# Altium project Hardware_Controller_2019-20.PrjPCB
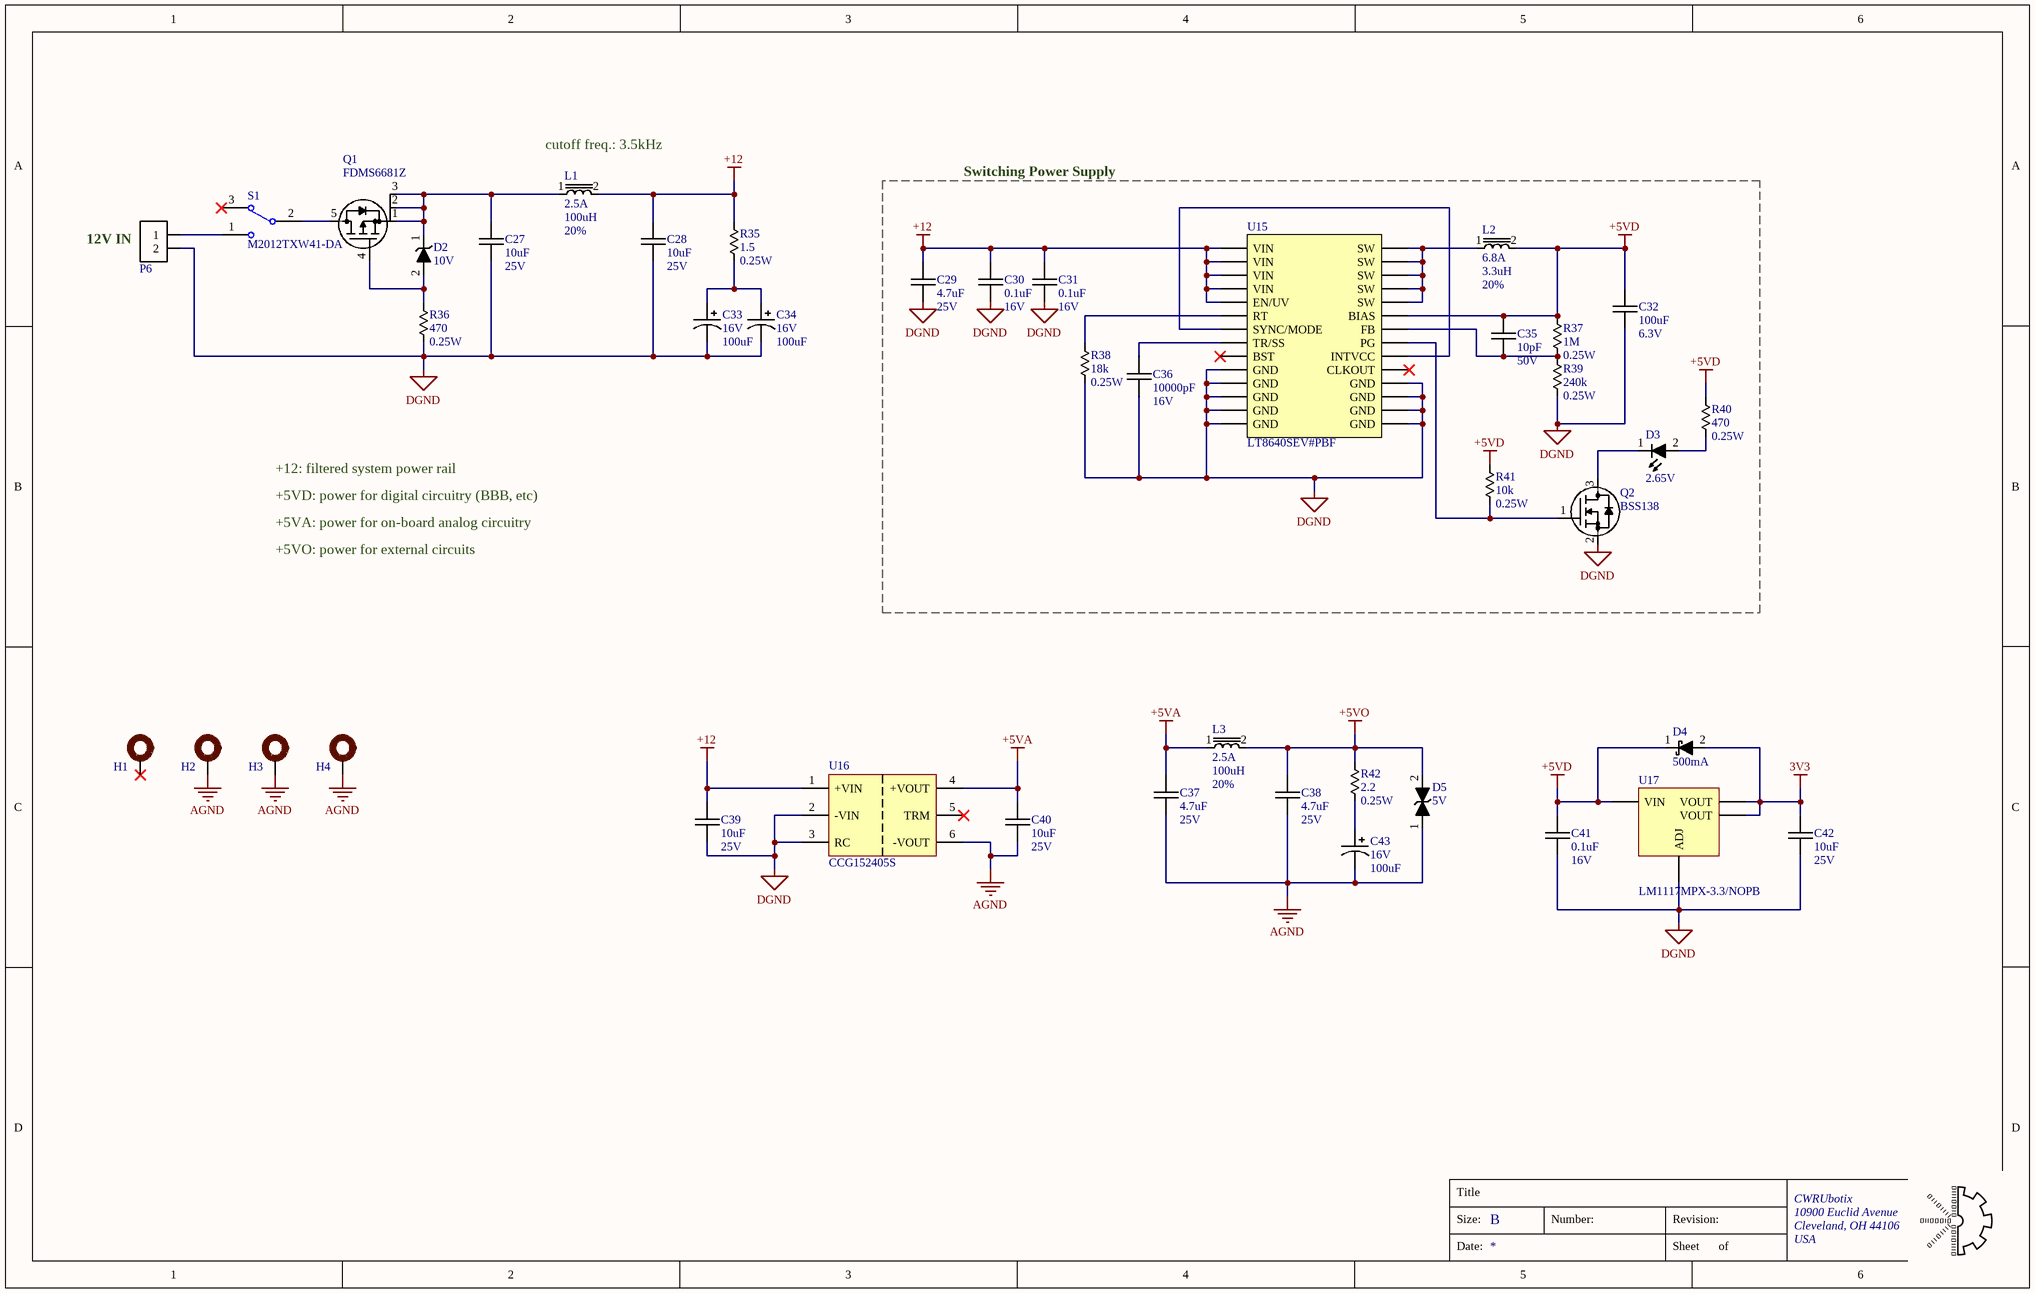
[diagram p0: power_SCH1.SchDoc]
4 sheets, 128 parts. Net scope: flat (ports and power ports of the same name join across sheets).
Board file: HardwareControllerPCB.PcbDoc
Sheets:
  power_SCH1.SchDoc
  BBB_SCH2.SchDoc
  IO_SCH3.SchDoc
  Analog_SCH4.SchDoc

## Sheet power_SCH1.SchDoc
size B; Organization: CWRUbotix; Address1: 10900 Euclid Avenue; Address2: Cleveland, OH 44106; Address3: USA

### Parts
C27  Capacitance: 10uF  Voltage Rating: 25V  [chip_1206]  (hidden comment: cap_single_np)
C28  Capacitance: 10uF  Voltage Rating: 25V  [chip_1206]  (hidden comment: cap_single_np)
C29  Capacitance: 4.7uF  Voltage Rating: 25V  [chip_0805]  (hidden comment: cap_single_np)
C30  Capacitance: 0.1uF  Voltage Rating: 16V  [chip_0603]  (hidden comment: cap_single_np)
C31  Capacitance: 0.1uF  Voltage Rating: 16V  [chip_0603]  (hidden comment: cap_single_np)
C32  Capacitance: 100uF  Voltage Rating: 6.3V  [chip_1206]  (hidden comment: cap_single_np)
C33  Voltage Rating: 16V  Capacitance: 100uF  [chip_2917_AVX_TAJD]  (hidden comment: cap_single_p)
C34  Voltage Rating: 16V  Capacitance: 100uF  [chip_2917_AVX_TAJD]  (hidden comment: cap_single_p)
C35  Capacitance: 10pF  Voltage Rating: 50V  [chip_0603]  (hidden comment: cap_single_np)
C36  Capacitance: 10000pF  Voltage Rating: 16V  [chip_0603]  (hidden comment: cap_single_np)
C37  Capacitance: 4.7uF  Voltage Rating: 25V  [chip_0805]  (hidden comment: cap_single_np)
C38  Capacitance: 4.7uF  Voltage Rating: 25V  [chip_0805]  (hidden comment: cap_single_np)
C39  Capacitance: 10uF  Voltage Rating: 25V  [chip_1206]  (hidden comment: cap_single_np)
C40  Capacitance: 10uF  Voltage Rating: 25V  [chip_1206]  (hidden comment: cap_single_np)
C41  Capacitance: 0.1uF  Voltage Rating: 16V  [chip_0603]  (hidden comment: cap_single_np)
C42  Capacitance: 10uF  Voltage Rating: 25V  [chip_1206]  (hidden comment: cap_single_np)
C43  Voltage Rating: 16V  Capacitance: 100uF  [chip_2917_AVX_TAJD]  (hidden comment: cap_single_p)
D2  Reverse Breakdown Voltage: 10V  [sod323_0]  (hidden comment: diode_1)
D3  Forward Voltage: 2.65V  [chip_0603]  (hidden comment: diode_4)
D4  Current Rating: 500mA  [sod323_0]  (hidden comment: diode_2)
D5  Reverse Breakdown Voltage: 5V  [do-214ac]  (hidden comment: diode_5)
H1  mounting_hole_0  [#8-32_SOCKET_HEAD]  (value not drawn)
H2  mounting_hole_0  [#8-32_SOCKET_HEAD]  (value not drawn)
H3  mounting_hole_0  [#8-32_SOCKET_HEAD]  (value not drawn)
H4  mounting_hole_0  [#8-32_SOCKET_HEAD]  (value not drawn)
L1  Current Rating: 2.5A  Inductance: 100uH  Tolerance: 20%  [WURTH_7447709101]  (hidden comment: ind_1)
L2  Current Rating: 6.8A  Inductance: 3.3uH  Tolerance: 20%  [TDK_SPM6530]  (hidden comment: ind_1)
L3  Current Rating: 2.5A  Inductance: 100uH  Tolerance: 20%  [WURTH_7447709101]  (hidden comment: ind_1)
P6  conn-2x1_0  [TERM_3.50MM_2x1_0]  (value not drawn)
Q1  Manufacturer PN: FDMS6681Z  [PQFN-8-5x6]  (hidden comment: p-mosfet_3)
Q2  Manufacturer PN: BSS138  [sot-23-3]  (hidden comment: n-mosfet_1)
R35  Resistance: 1.5  Power Rating: 0.25W  [chip_0805]  (hidden comment: res_single)
R36  Resistance: 470  Power Rating: 0.25W  [chip_0603]  (hidden comment: res_single)
R37  Resistance: 1M  Power Rating: 0.25W  [chip_0603]  (hidden comment: res_single)
R38  Resistance: 18k  Power Rating: 0.25W  [chip_0603]  (hidden comment: res_single)
R39  Resistance: 240k  Power Rating: 0.25W  [chip_0603]  (hidden comment: res_single)
R40  Resistance: 470  Power Rating: 0.25W  [chip_0603]  (hidden comment: res_single)
R41  Resistance: 10k  Power Rating: 0.25W  [chip_0603]  (hidden comment: res_single)
R42  Resistance: 2.2  Power Rating: 0.25W  [chip_0805]  (hidden comment: res_single)
S1  Manufacturer PN: M2012TXW41-DA  [M2012TXG41-DC]  (hidden comment: SW-SPDT)
U15  Manufacturer PN: LT8640SEV#PBF  [LQFN-24_0]  (hidden comment: LT8640S)
U16  Manufacturer PN: CCG152405S  [CCG15]  (hidden comment: CCG15)
U17  Manufacturer PN: LM1117MPX-3.3/NOPB  [sot-223-4]  (hidden comment: LM1117)

### Blocks framed on the sheet
Switching Power Supply: C29-C32 C35 C36 D3 L2 Q2 R37-R41 U15

### Nets
3V3: C42.1 D4.2 U17.2(VOUT) U17.4(VOUT)
+5VA: C37.1 C40.1 L3.1 U16.4(+VOUT)
+5VD: C32.1 C35.1 C41.1 D4.1 L2.2 R37.1 R40.2 R41.1 U15.1(BIAS) U17.3(VIN)
+5VO: C38.1 D5.2 L3.2 R42.1
+12: C28.1 C29.1 C30.1 C31.1 C39.1 L1.2 R35.1 U15.5(VIN) U15.6(VIN) U15.13(VIN) U15.14(VIN) U15.17(EN/UV) U16.1(+VIN)
AGND: C37.2 C38.2 C40.2 C43.2 D5.1 H2.0(A) H3.0(A) H4.0(A) U16.6(-VOUT)
DGND: C27.2 C28.2 C29.2 C30.2 C31.2 C32.2 C33.2 C34.2 C36.2 C39.2 C41.2 C42.2 P6.2 Q2.2(S) R36.2 R38.2 R39.2 U15.3(GND) U15.4(GND) U15.15(GND) U15.16(GND) U15.25(GND) U15.26(GND) U15.27(GND) U15.28(GND) U16.2(-VIN) U16.3(RC) U17.1(ADJ)
NetC27_1: C27.1 D2.1 L1.1 Q1.1(S) Q1.2(S) Q1.3(S)
NetC33_1: C33.1 C34.1 R35.2
NetC35_2: C35.2 R37.2 R39.1 U15.24(FB)
NetC36_1: C36.1 U15.21(TR/SS)
NetC43_1: C43.1 R42.2
NetD2_2: D2.2 Q1.4(G) R36.1
NetD3_1: D3.1 Q2.3(D)
NetD3_2: D3.2 R40.1
NetL2_1: L2.1 U15.8(SW) U15.9(SW) U15.10(SW) U15.11(SW) U15.12(SW)
NetP6_1: P6.1 S1.1
NetQ1_5: Q1.5(D) S1.2
NetQ2_1: Q2.1(G) R41.2 U15.23(PG)
NetR38_1: R38.1 U15.18(RT)
NetU15_2: U15.2(INTVCC) U15.20(SYNC/MODE)

Not connected (* = marked no-connect by the designer): H1 0(A)*; S1 3*; U15 7(BST)* 19(CLKOUT)*; U16 5(TRM)*

### Notes on the sheet
- (near L1) cutoff freq.: 3.5kHz
- (near P6) 12V IN
- +12: filtered system power rail
- +5VD: power for digital circuitry (BBB, etc)
- +5VO: power for external circuits
- +5VA: power for on-board analog circuitry
- Title
- Size:
- B
- Number:
- Revision:
- Date:
- Sheet
- of

### Library data of the parts
C27 C28 C39 C40 C42 = CAP-00539: CAP, 10uF, ±10%, 25V, X7R, 1206; Manufacturer: Samsung; Manufacturer PN: CL31B106KAHNNNE; Tolerance: ±10%; Part Number: CAP-00539; Type: X7R
C29 C37 C38 = CAP-00128: CAP, 4.7uF, 10%, 25V, X7R, 0805; Manufacturer: Murata; Manufacturer PN: GRM21BR71E475KA73L; Tolerance: 10%; Part Number: CAP-00128; Type: X7R
C30 C31 C41 = CAP-00542: CAP, 0.1uF, ±10%, 16V, X7R, 0603; Manufacturer: Murata; Tolerance: ±10%; Part Number: CAP-00542; Type: X7R
C32 = CAP-00551: CAP, 100uF, ±20%, 6.3V, X5R, 1206; Manufacturer: Samsung Electro-Mechanics; Manufacturer PN: CL31A107MQHNNNE; Tolerance: ±20%; Part Number: CAP-00551; Type: X5R; Cost: $0.64
C33 C34 C43 = CAP-00550: CAP, 100uF, ±10%, 16V, Tantalum, 2917; Manufacturer: AVX; Manufacturer PN: TAJD107K016RNJ; Tolerance: ±10%; Part Number: CAP-00550; Type: Tantalum; Cost: $0.94
C35 = CAP-00471: CAP, 10pF, ±2%, 50V, C0G, 0603; Manufacturer: Murata; Manufacturer PN: GRM1885C1H100GA01D; Tolerance: ±2%; Part Number: CAP-00471; Type: C0G
C36 = CAP-00543: CAP, 10000pF, ±10%, 16V, X7R, 0603; Tolerance: ±10%; Part Number: CAP-00543; Type: X7R
D2 = DIO-00019: Dio Zen, 10V, 2%, 200mW, SOD-323; Manufacturer: ON Semi; Manufacturer PN: MM3Z10VST1G; Forward Voltage: 900mV; Type: Zener; Part Number: DIO-00019; Tolerance: 2%; Power Rating: 200mW
D3 = DIO-00049: LED, Blue, 0603, Low current, HELI2 Series; Manufacturer: Kingbright; Manufacturer PN: APT1608LVBC/D; Reverse Breakdown Voltage: 5V; Current Rating: 30mA; Power Rating: 120mW; Type: LED; Part Number: DIO-00049; Cost: 0.58
D4 = DIO-00000: Dio Shtky, 500mA, 0.62V, 30V, SOD-323; Manufacturer: ON Semi; Manufacturer PN: NSR0530HT1G; Forward Voltage: 620mV; Type: Schottky; Reverse Breakdown Voltage: 30V; Part Number: DIO-00000
D5 = DIO-00036: TVS, 5V, 400W; Manufacturer: ST; Manufacturer PN: SMAJ5.0A-TR; Type: TVS; Part Number: DIO-00036; Power Rating: 400W
H1-H4 = MISC-00027: #8-32 Mounting Hole for Socket Head Cap Screw; Part Number: MISC-00027
L1 L3 = MAG-00102: Ind, 100uH, 20%, 2.5A, 0.11 Ohm; Manufacturer: Wurth; Manufacturer PN: 7447709101; DCR: 110mOhm; Part Number: MAG-00102; Cost: 2.41; Weight: 7
L2 = MAG-00093: Ind, 3.3uH, 20%, 6.8A, EP5; Manufacturer: TDK; Manufacturer PN: SPM6530T-3R3M; DCR: 29.7 mOhm; Part Number: MAG-00093; Cost: 1.41; Weight: 0.7
P6 = CONN-00023: Term Blk, 2 Pos, 16A, 3.5mm Pitch; Manufacturer: Phoenix Contact; Manufacturer PN: 1861933; Positions per level: 2; Levels: 1; Current: 16; Part Number: CONN-00023; Type: Terminal Block; Cost: 0.79
Q1 = XSTR-00026: XSTR PMOS, 21.1A, 30V, Vgs 3V, PQFN8 5X6; Manufacturer: ON Semi; Max Power: 73W; Type: PFET; Max Current: 21.1A; Max Voltage: 30V; Part Number: XSTR-00026; Vgs/Vce: 3V; Cost: 1.82
Q2 = XSTR-00017: XSTR NMOS, 220mA, 50V, Vgs 1.3V, SOT-23-3; Manufacturer: ON Semi; Max Power: 360mW; Type: NFET; Max Current: 220mA; Max Voltage: 50V; Part Number: XSTR-00017; Vgs/Vce: 1.3V; Cost: 0.31
R35 = RES-00600: RES SMD 1.5 OHM 1% 1/4W 0805; Tolerance: 1%; Part Number: RES-00600
R36 R40 = RES-00236: RES SMD 470 OHM 1% 1/4W 0603; Manufacturer: Panasonic; Manufacturer PN: ERJ-PA3F4700V; Tolerance: 1%; Part Number: RES-00236
R37 = RES-00362: RES SMD 1M OHM 1% 1/4W 0603; Manufacturer: Panasonic; Manufacturer PN: ERJ-PA3F1004V; Tolerance: 1%; Part Number: RES-00362
R38 = RES-00356: RES SMD 18K OHM 1% 1/4W 0603; Manufacturer: Panasonic; Manufacturer PN: ERJ-PA3F1802V; Tolerance: 1%; Part Number: RES-00356
R39 = RES-00397: RES SMD 240K OHM 1% 1/4W 0603; Manufacturer: Panasonic; Manufacturer PN: ERJ-PA3F2403V; Tolerance: 1%; Part Number: RES-00397
R41 = RES-00306: RES SMD 10K OHM 1% 1/4W 0603; Manufacturer: Panasonic; Manufacturer PN: ERJ-PA3F1002V; Tolerance: 1%; Part Number: RES-00306; Cost: 0.144
R42 = RES-00601: RES SMD 2.2 OHM 1% 1/4W 0805; Tolerance: 1%; Part Number: RES-00601
S1 = MISC-00009: Switch, SPDT, Rocker, Thru-hole, Right-angle; Manufacturer: NKK Switches; Current Rating: *A; ComponentLink1Description: Manufacturer Link; ComponentLink1URL: http://www.apem.com; Part Number: MISC-00009; Cost: 5.1
U15 = PWREG-00013: SW Reg, Silent Switcher 2, Low EMI; Manufacturer: Analog Devices; Voltage Range In: 3 - 42V; Voltage Range Out: 0.97 - 42V; Max Current: 6A; Frequency: 200kHz-3MHz; Reg Type: SW Buck; Fixed/Adj: Adj; Part Number: PWREG-00013; Cost: 11.15
U16 = PWREG-00021: Module, Isolated, 5V, 3A; Manufacturer: TDK-Lambda; Voltage Range In: 9 - 36V; Fixed/Adj: Fixed; Part Number: PWREG-00021; Voltage Range Out: 5V; Max Current: 3A; Weight: 20
U17 = PWREG-00018: REG, Linear, Fixed 3V3, 800mA, SOT-223; Manufacturer: TI; Voltage Range In: 4.5 - 15V; Voltage Range Out: 3.3V; Part Number: PWREG-00018; Max Current: 800mA; Reg Type: Linear; Fixed/Adj: Fixed; Cost: 1.14

## Sheet BBB_SCH2.SchDoc
size B; Organization: CWRUbotix; Address1: 10900 Euclid Avenue; Address2: Cleveland, OH 44106; Address3: USA
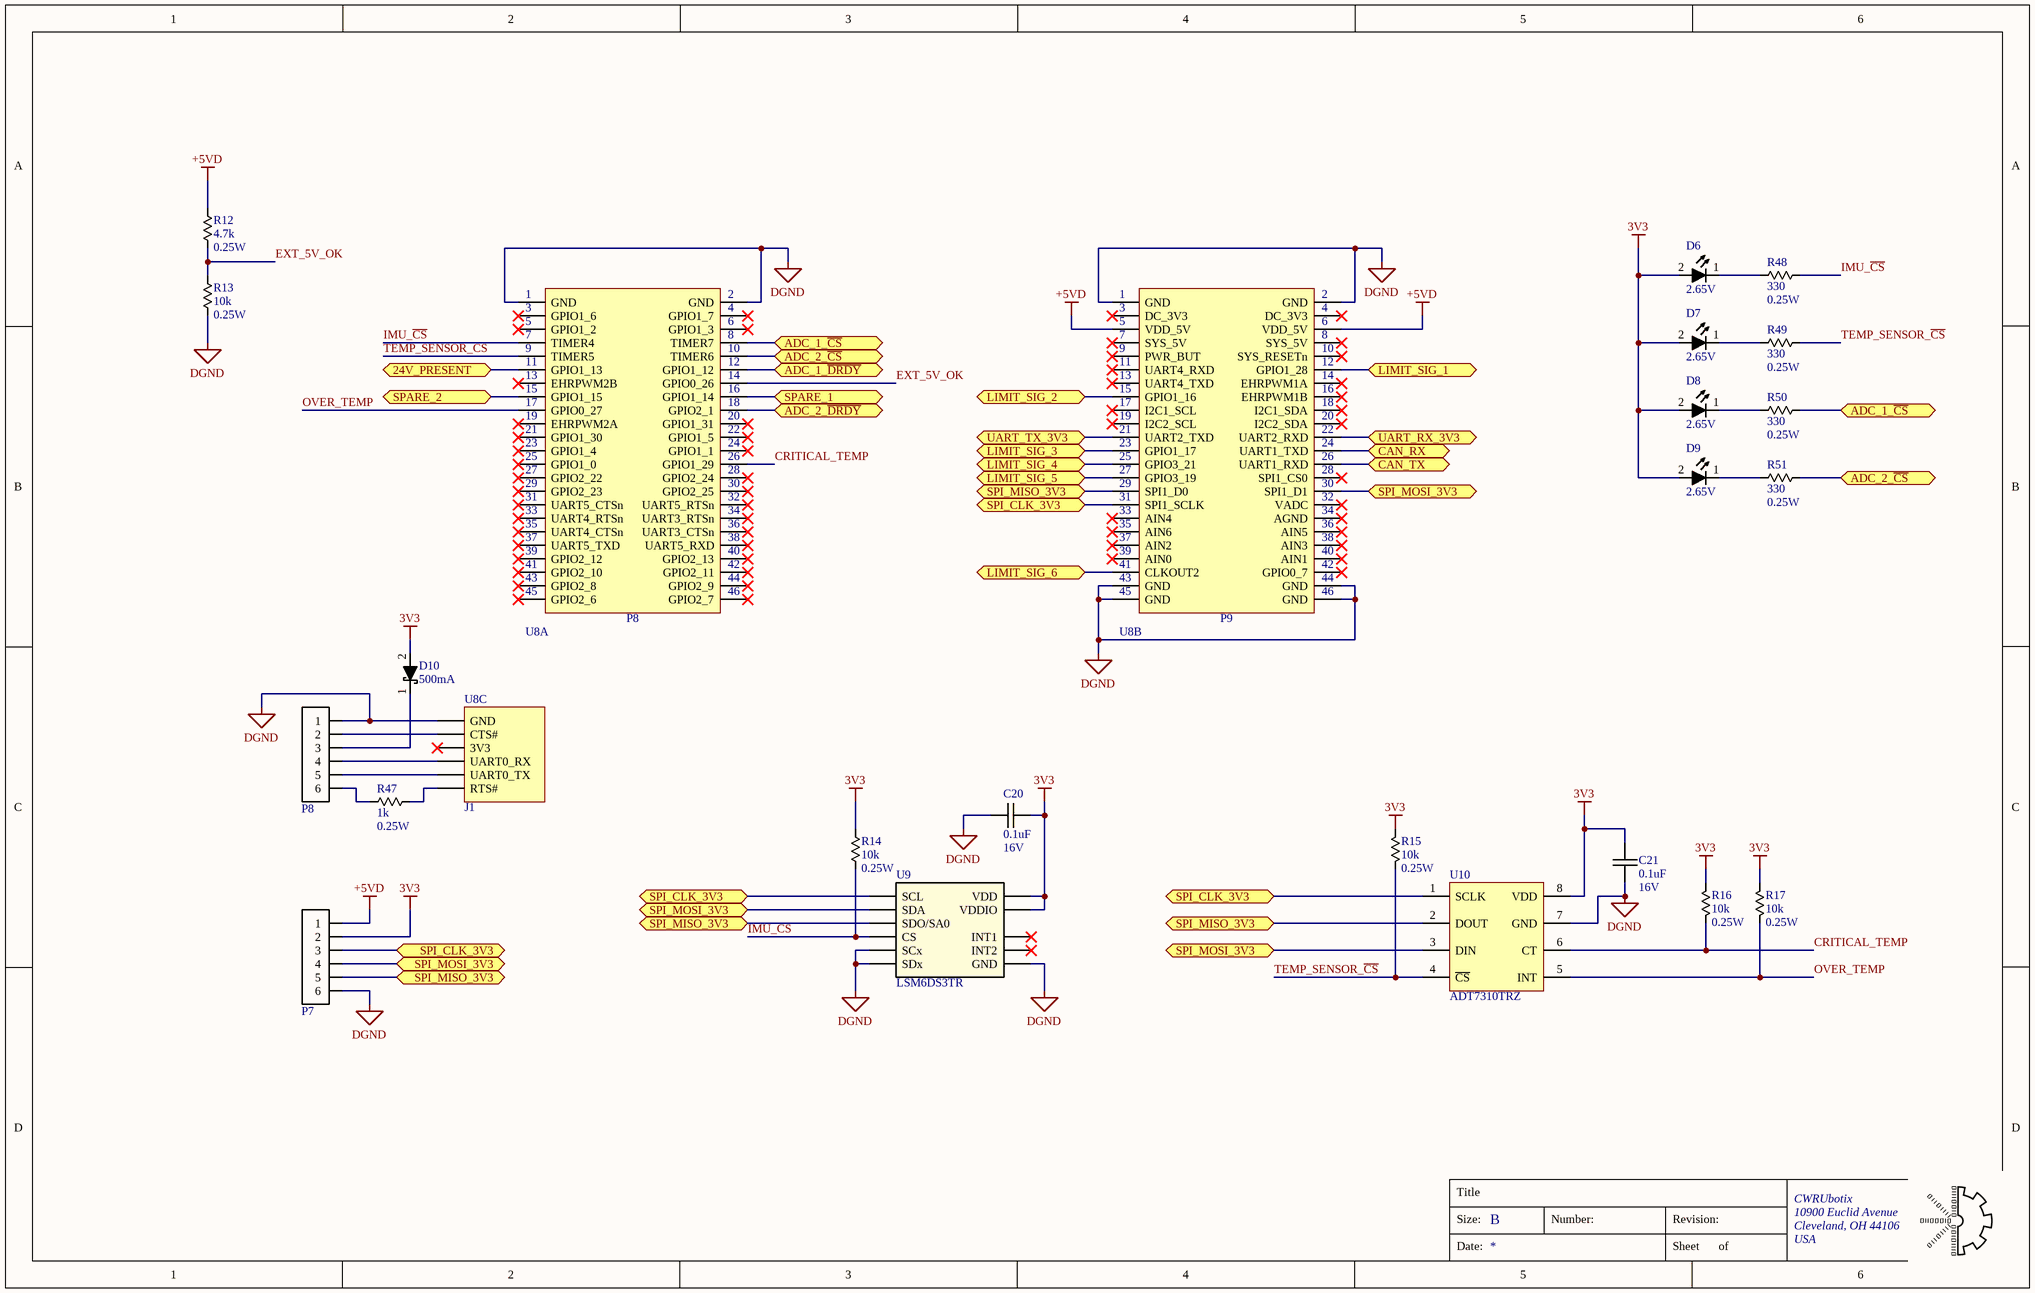
[diagram p1: BBB_SCH2.SchDoc]

### Parts
C20  Capacitance: 0.1uF  Voltage Rating: 16V  [chip_0603]  (hidden comment: cap_single_np)
C21  Capacitance: 0.1uF  Voltage Rating: 16V  [chip_0603]  (hidden comment: cap_single_np)
D6  Forward Voltage: 2.65V  [chip_0603]  (hidden comment: diode_4)
D7  Forward Voltage: 2.65V  [chip_0603]  (hidden comment: diode_4)
D8  Forward Voltage: 2.65V  [chip_0603]  (hidden comment: diode_4)
D9  Forward Voltage: 2.65V  [chip_0603]  (hidden comment: diode_4)
D10  Current Rating: 500mA  [sod323_0]  (hidden comment: diode_2)
P7  conn-6x1_0  [HDDR_6X1_0]  (value not drawn)
P8  conn-6x1_0  [SOCK_6x1_0]  (value not drawn)
R12  Resistance: 4.7k  Power Rating: 0.25W  [chip_0603]  (hidden comment: res_single)
R13  Resistance: 10k  Power Rating: 0.25W  [chip_0603]  (hidden comment: res_single)
R14  Resistance: 10k  Power Rating: 0.25W  [chip_0603]  (hidden comment: res_single)
R15  Resistance: 10k  Power Rating: 0.25W  [chip_0603]  (hidden comment: res_single)
R16  Resistance: 10k  Power Rating: 0.25W  [chip_0603]  (hidden comment: res_single)
R17  Resistance: 10k  Power Rating: 0.25W  [chip_0603]  (hidden comment: res_single)
R47  Resistance: 1k  Power Rating: 0.25W  [chip_0603]  (hidden comment: res_single)
R48  Resistance: 330  Power Rating: 0.25W  [chip_0603]  (hidden comment: res_single)
R49  Resistance: 330  Power Rating: 0.25W  [chip_0603]  (hidden comment: res_single)
R50  Resistance: 330  Power Rating: 0.25W  [chip_0603]  (hidden comment: res_single)
R51  Resistance: 330  Power Rating: 0.25W  [chip_0603]  (hidden comment: res_single)
U8  BBB  [BEAGLEBONE]  (value not drawn)  (parts A,B,C of 3)
U9  Manufacturer PN: LSM6DS3TR  [LGA14]  (hidden comment: LSM6DS3)
U10  Manufacturer PN: ADT7310TRZ  [SO-8]  (hidden comment: ADT7310)

### Ports
24V_PRESENT (bidir), ADC_1_~{CS} (bidir), ADC_1_~{DRDY} (bidir), ADC_2_~{CS} (bidir), ADC_2_~{DRDY} (bidir), CAN_RX (bidir), CAN_TX (bidir), LIMIT_SIG_1 (bidir), LIMIT_SIG_2 (bidir), LIMIT_SIG_3 (bidir), LIMIT_SIG_4 (bidir), LIMIT_SIG_5 (bidir), LIMIT_SIG_6 (bidir), SPARE_1 (bidir), SPARE_2 (bidir), SPI_CLK_3V3 (bidir), SPI_MISO_3V3 (bidir), SPI_MOSI_3V3 (bidir), UART_RX_3V3 (bidir), UART_TX_3V3 (bidir)

### Nets
3V3: C20.2 C21.2 D6.2 D7.2 D8.2 D9.2 D10.2 P7.2 R14.1 R15.1 R16.1 R17.1 U9.5(VDDIO) U9.8(VDD) U10.8(VDD)
+5VD: P7.1 R12.2 U8.51(VDD_5V) U8.52(VDD_5V)
DGND: C20.1 C21.1 P7.6 P8.1 R13.2 U8.1(GND) U8.2(GND) U8.47(GND) U8.48(GND) U8.89(GND) U8.90(GND) U8.91(GND) U8.92(GND) U8.J1_1(GND) U9.2(SDx) U9.3(SCx) U9.6(GND) U10.7(GND)
24V_PRESENT: U8.11(GPIO1_13) ; port 24V_PRESENT
ADC_1_~{CS}: R50.2 U8.8(TIMER7) ; port ADC_1_~{CS}
ADC_1_~{DRDY}: U8.12(GPIO1_12) ; port ADC_1_~{DRDY}
ADC_2_~{CS}: R51.2 U8.10(TIMER6) ; port ADC_2_~{CS}
ADC_2_~{DRDY}: U8.18(GPIO2_1) ; port ADC_2_~{DRDY}
CAN_RX: U8.70(UART1_TXD) ; port CAN_RX
CAN_TX: U8.72(UART1_RXD) ; port CAN_TX
CRITICAL_TEMP: R16.2 U8.26(GPIO1_29) U10.6(CT)
EXT_5V_OK: R12.1 R13.1 U8.14(GPIO0_26)
IMU_~{CS}: R14.2 R48.2 U8.7(TIMER4) U9.12(CS)
LIMIT_SIG_1: U8.58(GPIO1_28) ; port LIMIT_SIG_1
LIMIT_SIG_2: U8.61(GPIO1_16) ; port LIMIT_SIG_2
LIMIT_SIG_3: U8.69(GPIO1_17) ; port LIMIT_SIG_3
LIMIT_SIG_4: U8.71(GPIO3_21) ; port LIMIT_SIG_4
LIMIT_SIG_5: U8.73(GPIO3_19) ; port LIMIT_SIG_5
LIMIT_SIG_6: U8.87(CLKOUT2) ; port LIMIT_SIG_6
OVER_TEMP: R17.2 U8.17(GPIO0_27) U10.5(INT)
SPARE_1: U8.16(GPIO1_14) ; port SPARE_1
SPARE_2: U8.15(GPIO1_15) ; port SPARE_2
SPI_CLK_3V3: P7.3 U8.77(SPI1_SCLK) U9.13(SCL) U10.1(SCLK) ; port SPI_CLK_3V3
SPI_MISO_3V3: P7.5 U8.75(SPI1_D0) U9.1(SDO/SA0) U10.2(DOUT) ; port SPI_MISO_3V3
SPI_MOSI_3V3: P7.4 U8.76(SPI1_D1) U9.14(SDA) U10.3(DIN) ; port SPI_MOSI_3V3
TEMP_SENSOR_~{CS}: R15.2 R49.2 U8.9(TIMER5) U10.4(~{CS})
UART_RX_3V3: U8.68(UART2_RXD) ; port UART_RX_3V3
UART_TX_3V3: U8.67(UART2_TXD) ; port UART_TX_3V3
NetD6_1: D6.1 R48.1
NetD7_1: D7.1 R49.1
NetD8_1: D8.1 R50.1
NetD9_1: D9.1 R51.1
NetD10_1: D10.1 P8.3
NetP8_2: P8.2 U8.J1_2(CTS#)
NetP8_4: P8.4 U8.J1_4(UART0_RX)
NetP8_5: P8.5 U8.J1_5(UART0_TX)
NetP8_6: P8.6 R47.1
NetR47_2: R47.2 U8.J1_6(RTS#)

Not connected (* = marked no-connect by the designer): U8 3(GPIO1_6)* 4(GPIO1_7)* 5(GPIO1_2)* 6(GPIO1_3)* 13(EHRPWM2B)* 19(EHRPWM2A)* 20(GPIO1_31)* 21(GPIO1_30)* 22(GPIO1_5)* 23(GPIO1_4)* 24(GPIO1_1)* 25(GPIO1_0)* 27(GPIO2_22)* 28(GPIO2_24)* 29(GPIO2_23)* 30(GPIO2_25)* 31(UART5_CTSn)* 32(UART5_RTSn)* 33(UART4_RTSn)* 34(UART3_RTSn)* 35(UART4_CTSn)* 36(UART3_CTSn)* 37(UART5_TXD)* 38(UART5_RXD)* 39(GPIO2_12)* 40(GPIO2_13)* 41(GPIO2_10)* 42(GPIO2_11)* 43(GPIO2_8)* 44(GPIO2_9)* 45(GPIO2_6)* 46(GPIO2_7)* 49(DC_3V3)* 50(DC_3V3)* 53(SYS_5V)* 54(SYS_5V)* 55(PWR_BUT)* 56(SYS_RESETn)* 57(UART4_RXD)* 59(UART4_TXD)* 60(EHRPWM1A)* 62(EHRPWM1B)* 63(I2C1_SCL)* 64(I2C1_SDA)* 65(I2C2_SCL)* 66(I2C2_SDA)* 74(SPI1_CS0)* 78(VADC)* 79(AIN4)* 80(AGND)* 81(AIN6)* 82(AIN5)* 83(AIN2)* 84(AIN3)* 85(AIN0)* 86(AIN1)* 88(GPIO0_7)* J1_3(3V3)*; U9 4(INT1)* 7(GND) 9(INT2)* 10(NC) 11(NC)

### Notes on the sheet
- Title
- Size:
- B
- Number:
- Revision:
- Date:
- Sheet
- of
- (in symbol MISC-00020, part A) P8
- (in symbol MISC-00020, part B) P9
- (in symbol MISC-00020, part C) J1

### Library data of the parts
C20 C21 = CAP-00542: as C30 on sheet power_SCH1; Tolerance: ±10%; Part Number: CAP-00542; Type: X7R
D6-D9 = DIO-00049: as D3 on sheet power_SCH1; Type: LED; Part Number: DIO-00049; Cost: 0.58
D10 = DIO-00000: as D4 on sheet power_SCH1; Reverse Breakdown Voltage: 30V; Part Number: DIO-00000
P7 = CONN-00008: Header 6x1, 0.1"; Positions per level: 6; Levels: 1; Part Number: CONN-00008
P8 = CONN-00046: Female Socket, 6x1, 0.1"; Manufacturer: Samtec; Manufacturer PN: SSW-106-01-F-S; Positions per level: 6; Levels: 1; Part Number: CONN-00046; Type: Socket; Cost: 0.8
R12 = RES-00470: RES SMD 4.7K OHM 1% 1/4W 0603; Manufacturer: Panasonic; Manufacturer PN: ERJ-PA3F4701V; Tolerance: 1%; Part Number: RES-00470
R13-R17 = RES-00306: as R41 on sheet power_SCH1; Tolerance: 1%; Part Number: RES-00306; Cost: 0.144
R47 = RES-00360: RES SMD 1K OHM 1% 1/4W 0603; Manufacturer: Panasonic; Manufacturer PN: ERJ-PA3F1001V; Tolerance: 1%; Part Number: RES-00360
R48-R51 = RES-00221: RES SMD 330 OHM 1% 1/4W 0603; Manufacturer: Panasonic; Manufacturer PN: ERJ-PA3F3300V; Tolerance: 1%; Part Number: RES-00221
U8 = MISC-00020: Beaglebone Black; Manufacturer PN: BEAGLEBONE; Part Number: MISC-00020
U9 = MISC-00012: Accel & Gyro, 3-Axis, SPI/I2C; Manufacturer: STM; Part Number: MISC-00012; Cost: 3
U10 = ANLG-00048: IC, 0.5°C Accurate 16-bit Digital SPI Temperature Sensor, SOIC-8, ADT7310; Manufacturer: Analog Devices; Part Number: ANLG-00048; Cost: 3.93

## Sheet IO_SCH3.SchDoc
size B; Organization: CWRUbotix; Address1: 10900 Euclid Avenue; Address2: Cleveland, OH 44106; Address3: USA
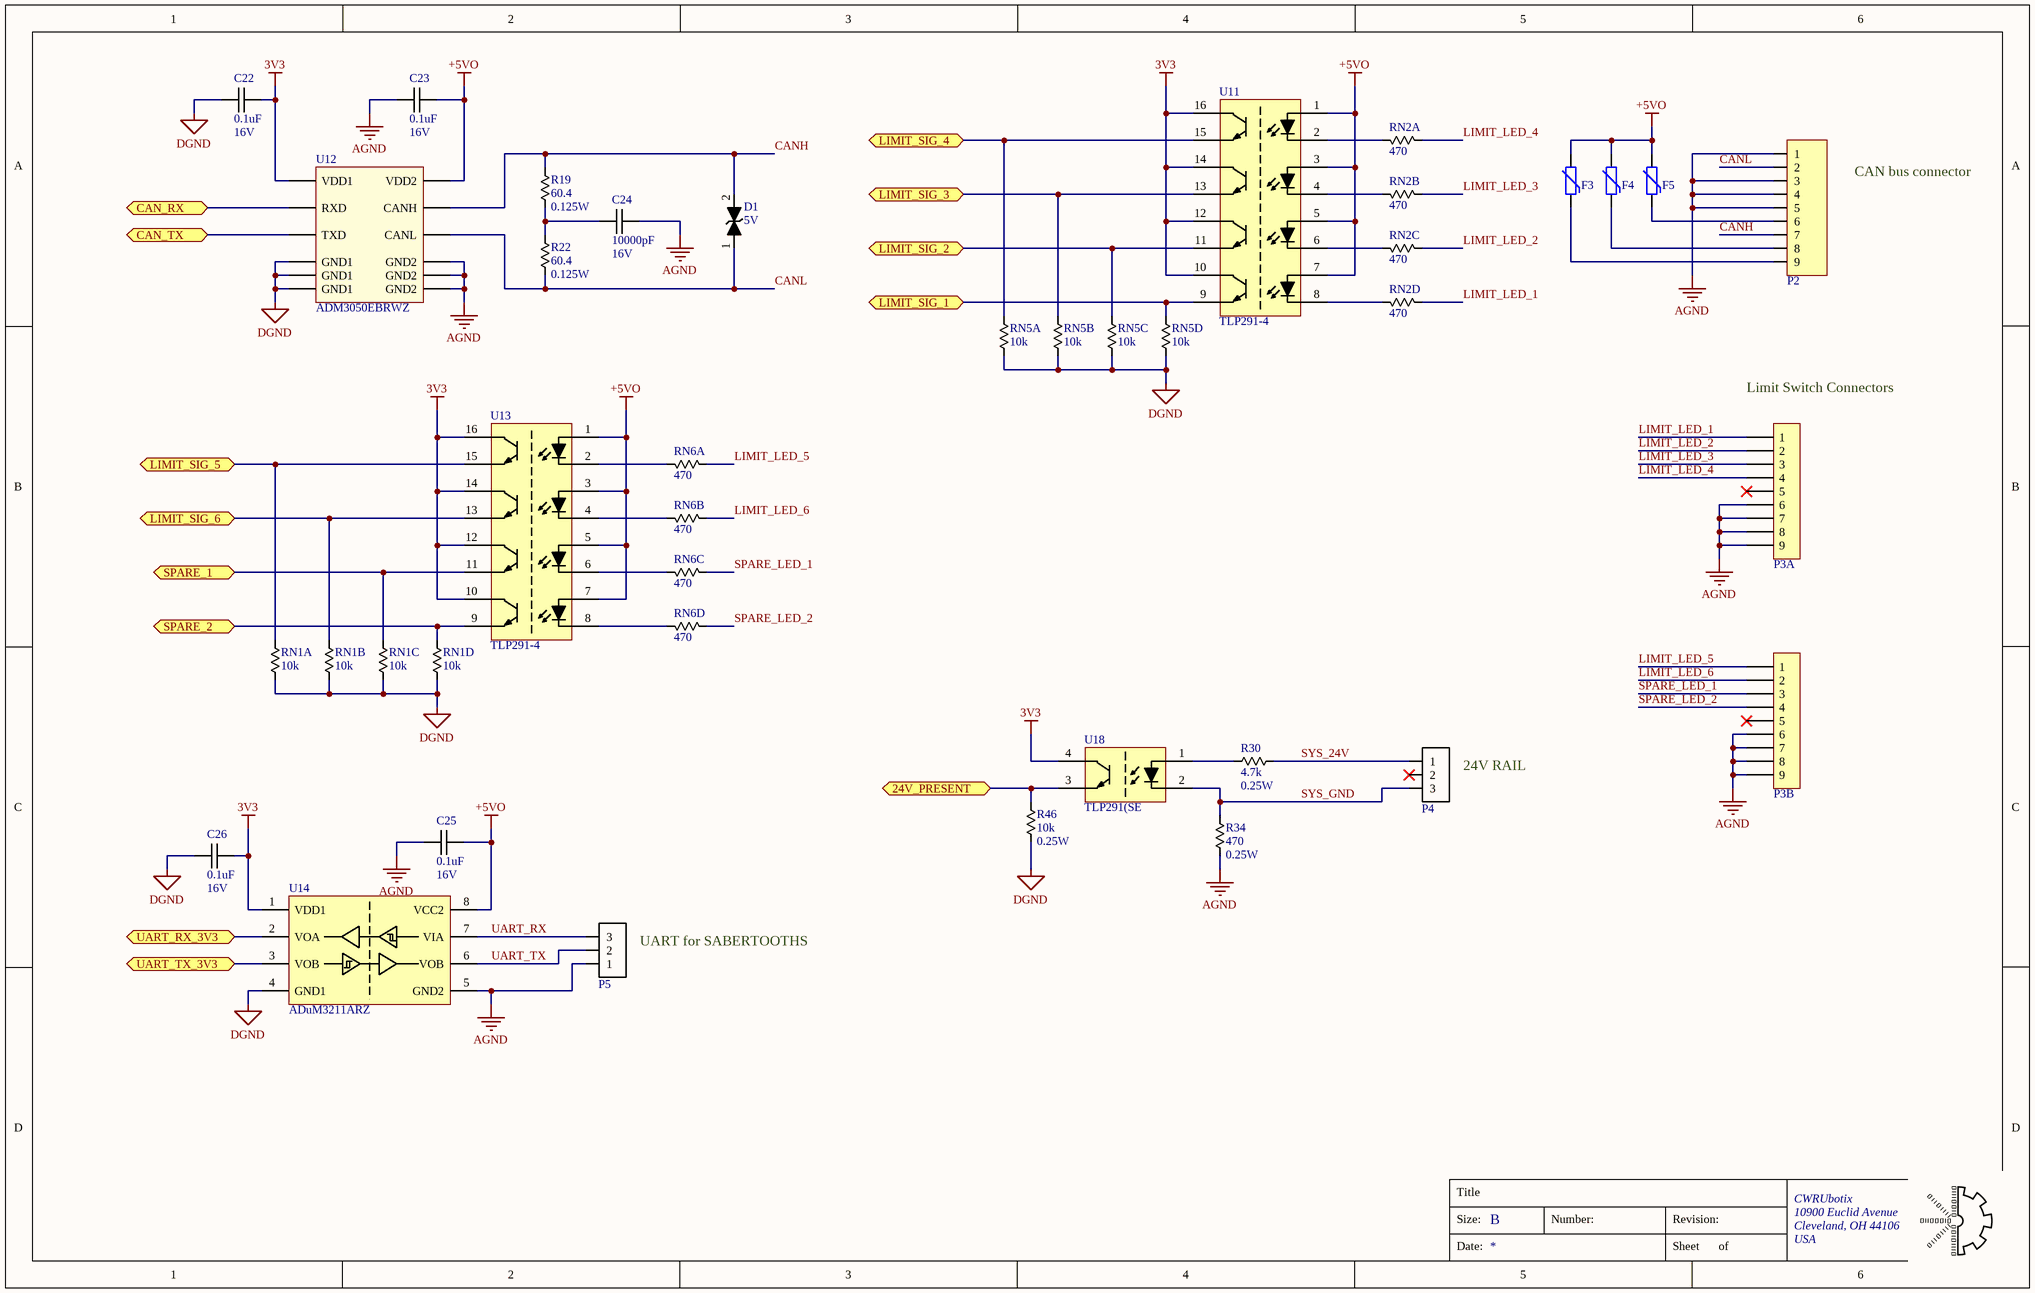
[diagram p2: IO_SCH3.SchDoc]

### Parts
C22  Capacitance: 0.1uF  Voltage Rating: 16V  [chip_0603]  (hidden comment: cap_single_np)
C23  Capacitance: 0.1uF  Voltage Rating: 16V  [chip_0603]  (hidden comment: cap_single_np)
C24  Capacitance: 10000pF  Voltage Rating: 16V  [chip_0603]  (hidden comment: cap_single_np)
C25  Capacitance: 0.1uF  Voltage Rating: 16V  [chip_0603]  (hidden comment: cap_single_np)
C26  Capacitance: 0.1uF  Voltage Rating: 16V  [chip_0603]  (hidden comment: cap_single_np)
D1  Reverse Breakdown Voltage: 5V  [do-214ac]  (hidden comment: diode_5)
F3  PTC_0  [chip_1206]  (value not drawn)
F4  PTC_0  [chip_1206]  (value not drawn)
F5  PTC_0  [chip_1206]  (value not drawn)
P2  conn-9x1_0  [182-009-213RYY1]  (value not drawn)
P3  conn-9x1_x2  [D_SUB_9x2_0]  (value not drawn)  (parts A,B of 2)
P4  conn-3x1_0  [JST_PHR_3_0]  (value not drawn)
P5  conn-3x1_0  [JST_PHR_3_0]  (value not drawn)
R19  Resistance: 60.4  Power Rating: 0.125W  [chip_0805]  (hidden comment: res_single)
R22  Resistance: 60.4  Power Rating: 0.125W  [chip_0805]  (hidden comment: res_single)
R30  Resistance: 4.7k  Power Rating: 0.25W  [chip_0603]  (hidden comment: res_single)
R34  Resistance: 470  Power Rating: 0.25W  [chip_0603]  (hidden comment: res_single)
R46  Resistance: 10k  Power Rating: 0.25W  [chip_0603]  (hidden comment: res_single)
RN1  Resistance: 10k  [chip_1206_arr]  (hidden comment: res_array_4)  (parts A,B,C,D of 4)
RN2  Resistance: 470  [chip_1206_arr]  (hidden comment: res_array_4)  (parts A,B,C,D of 4)
RN5  Resistance: 10k  [chip_1206_arr]  (hidden comment: res_array_4)  (parts A,B,C,D of 4)
RN6  Resistance: 470  [chip_1206_arr]  (hidden comment: res_array_4)  (parts A,B,C,D of 4)
U11  TLP291-4  [SO-16]
U12  Manufacturer PN: ADM3050EBRWZ  [SOW-16]  (hidden comment: ADM3050E)
U13  TLP291-4  [SO-16]
U14  Manufacturer PN: ADuM3211ARZ  [SO-8]  (hidden comment: ADuM3211)
U18  Manufacturer PN: TLP291(SE  [SO-4]  (hidden comment: opto_0)

### Ports
24V_PRESENT (bidir), CAN_RX (bidir), CAN_TX (bidir), LIMIT_SIG_1 (bidir), LIMIT_SIG_2 (bidir), LIMIT_SIG_3 (bidir), LIMIT_SIG_4 (bidir), LIMIT_SIG_5 (bidir), LIMIT_SIG_6 (bidir), SPARE_1 (bidir), SPARE_2 (bidir), UART_RX_3V3 (bidir), UART_TX_3V3 (bidir)

### Nets
3V3: C22.2 C26.2 U11.10 U11.12 U11.14 U11.16 U12.1(VDD1) U13.10 U13.12 U13.14 U13.16 U14.1(VDD1) U18.4(C)
+5VO: C23.1 C25.2 F3.2 F4.2 F5.2 U11.1 U11.3 U11.5 U11.7 U12.16(VDD2) U13.1 U13.3 U13.5 U13.7 U14.8(VCC2)
AGND: C23.2 C24.1 C25.1 P2.1 P2.3 P2.4 P2.5 P3.6 P3.7 P3.8 P3.9 P3.15(6) P3.16(7) P3.17(8) P3.18(9) P5.1 R34.1 U12.9(GND2) U12.10(GND2) U12.15(GND2) U14.5(GND2)
DGND: C22.1 C26.1 R46.2 RN1.5 RN1.6 RN1.7 RN1.8 RN5.5 RN5.6 RN5.7 RN5.8 U12.2(GND1) U12.7(GND1) U12.8(GND1) U14.4(GND1)
24V_PRESENT: R46.1 U18.3(E) ; port 24V_PRESENT
CAN_RX: U12.3(RXD) ; port CAN_RX
CAN_TX: U12.6(TXD) ; port CAN_TX
CANH: D1.2 P2.7 R19.1 U12.13(CANH)
CANL: D1.1 P2.2 R22.2 U12.12(CANL)
LIMIT_LED_1: P3.1 RN2.4
LIMIT_LED_2: P3.2 RN2.3
LIMIT_LED_3: P3.3 RN2.2
LIMIT_LED_4: P3.4 RN2.1
LIMIT_LED_5: P3.10(1) RN6.1
LIMIT_LED_6: P3.11(2) RN6.2
LIMIT_SIG_1: RN5.4 U11.9 ; port LIMIT_SIG_1
LIMIT_SIG_2: RN5.3 U11.11 ; port LIMIT_SIG_2
LIMIT_SIG_3: RN5.2 U11.13 ; port LIMIT_SIG_3
LIMIT_SIG_4: RN5.1 U11.15 ; port LIMIT_SIG_4
LIMIT_SIG_5: RN1.1 U13.15 ; port LIMIT_SIG_5
LIMIT_SIG_6: RN1.2 U13.13 ; port LIMIT_SIG_6
SPARE_1: RN1.3 U13.11 ; port SPARE_1
SPARE_2: RN1.4 U13.9 ; port SPARE_2
SPARE_LED_1: P3.12(3) RN6.3
SPARE_LED_2: P3.13(4) RN6.4
SYS_24V: P4.1 R30.2
SYS_GND: P4.3 R34.2 U18.2(A)
UART_RX: P5.3 U14.7(VIA)
UART_RX_3V3: U14.2(VOA) ; port UART_RX_3V3
UART_TX: P5.2 U14.6(VOB)
UART_TX_3V3: U14.3(VOB) ; port UART_TX_3V3
NetC24_2: C24.2 R19.2 R22.1
NetF3_1: F3.1 P2.9
NetF4_1: F4.1 P2.8
NetF5_1: F5.1 P2.6
NetR30_1: R30.1 U18.1(A)
NetRN2_5: RN2.5 U11.8
NetRN2_6: RN2.6 U11.6
NetRN2_7: RN2.7 U11.4
NetRN2_8: RN2.8 U11.2
NetRN6_5: RN6.5 U13.8
NetRN6_6: RN6.6 U13.6
NetRN6_7: RN6.7 U13.4
NetRN6_8: RN6.8 U13.2

Not connected (* = marked no-connect by the designer): P3 5* 14(5)*; P4 2*; U12 4(NC1) 5(NC2) 11(NC3) 14(NC4)

### Notes on the sheet
- CAN bus connector
- (near P3) Limit Switch Connectors
- (near P4) 24V RAIL
- (near P5) UART for SABERTOOTHS
- Title
- Size:
- B
- Number:
- Revision:
- Date:
- Sheet
- of

### Library data of the parts
C22 C23 C25 C26 = CAP-00542: as C30 on sheet power_SCH1; Tolerance: ±10%; Part Number: CAP-00542; Type: X7R
C24 = CAP-00543: CAP, 10000pF, ±10%, 16V, X7R, 0603; Tolerance: ±10%; Part Number: CAP-00543; Type: X7R
D1 = DIO-00036: as D5 on sheet power_SCH1; Type: TVS; Part Number: DIO-00036; Power Rating: 400W
F3-F5 = MISC-00008: PTC Resettable fuse, 6V, 500mA, 1206; Manufacturer: Eaton; Manufacturer PN: PTS12066V050; TEMP_CO: *; Part Number: MISC-00008; Cost: 0.3
P2 = CONN-00035: D-Sub, 9-pin; Manufacturer: NorComp; Manufacturer PN: 182-009-213R561; Positions per level: 9; Levels: 1; Part Number: CONN-00035; Type: Thru-hole; Cost: 2.27; Weight: 8.89
P3 = CONN-00025: D-Sub, Dual 9-pin; Manufacturer PN: 178-009-513R571; Manufacturer: NorComp; Positions per level: 9; Levels: 2; Part Number: CONN-00025; Type: Thru-hole; Cost: 7.32; Weight: 22.69
P4 P5 = CONN-00047: JST PH 3x1, THT, 2.00mm Pitch; Manufacturer PN: B3B-PH-K; Positions per level: 3; Levels: 1; Part Number: CONN-00047; Type: Header; Manufacturer: JST; Cost: 0.19
R19 R22 = RES-00161: RES SMD 60.4 OHM 1% 1/8W 0805; Manufacturer: Rohm Semiconductor; Manufacturer PN: KTR10EZPF60R4; Tolerance: 1%; Part Number: RES-00161
R30 = RES-00470: as R12 on sheet BBB_SCH2; Tolerance: 1%; Part Number: RES-00470
R34 = RES-00236: as R36 on sheet power_SCH1; Tolerance: 1%; Part Number: RES-00236
R46 = RES-00306: as R41 on sheet power_SCH1; Tolerance: 1%; Part Number: RES-00306; Cost: 0.144
RN1 RN5 = RES-00697: RES ARRAY 4 RES 10k OHM 5% 1/16W 1206; Manufacturer PN: 742C083103JP; Manufacturer: CTS Resistor Products; Power Rating: 1/16W; Part Number: RES-00697; Tolerance: 5%; Cost: 0.27
RN2 RN6 = RES-00698: RES ARRAY 4 RES 470 OHM 5% 1/16W 1206; Manufacturer PN: EXB-38V471JV; Manufacturer: Panasonic; Tolerance: 0.05; Power Rating: 1/16W; Part Number: RES-00698; Cost: 0.1
U11 U13 = IFACE-00012: Opto-Coupler Array, Photo-Transistor Output, TLP291-4; Manufacturer: Toshiba; Manufacturer PN: TLP291-4; Part Number: IFACE-00012
U12 = IFACE-00009: Isolated CANbus Transceiver, Single channel, ADM3050E; Manufacturer: Analog Devices; Part Number: IFACE-00009; Cost: 9.62
U14 = IFACE-00015: Digital Isolator, Dual-Channel, ADuM3211; Manufacturer: Analog Devices; Part Number: IFACE-00015; Cost: 2.87
U18 = ANLG-00049: IC, Opto-Coupler, 3750 Vrms, Wide SOIC-4, TLP291(SE; Manufacturer: Toshiba; Part Number: ANLG-00049; Cost: 0.45

## Sheet Analog_SCH4.SchDoc
size B; Organization: CWRUbotix; Address1: 10900 Euclid Avenue; Address2: Cleveland, OH 44106; Address3: USA
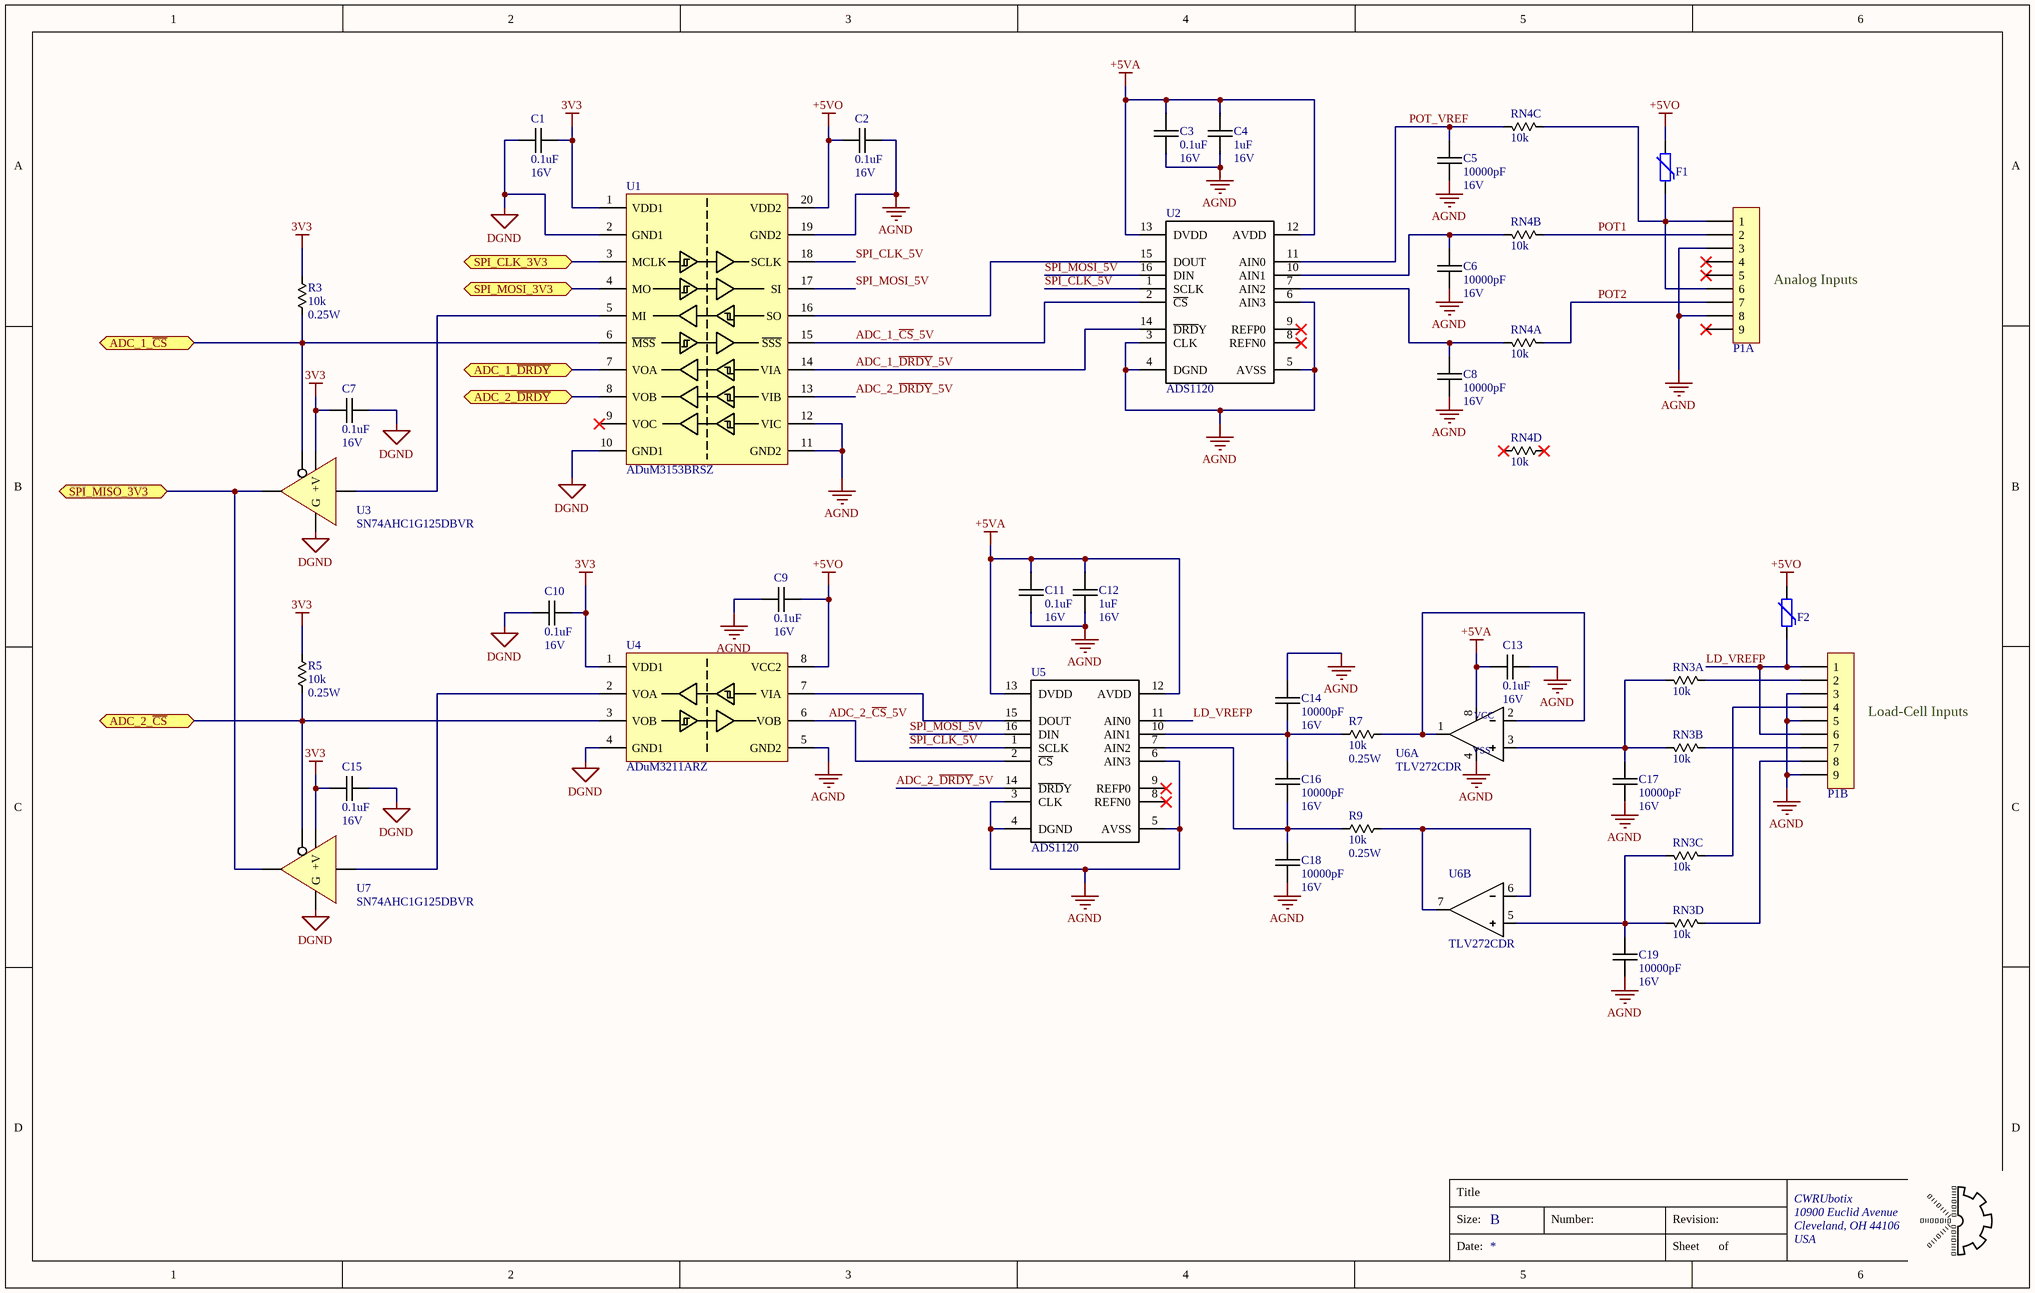
[diagram p3: Analog_SCH4.SchDoc]

### Parts
C1  Capacitance: 0.1uF  Voltage Rating: 16V  [chip_0603]  (hidden comment: cap_single_np)
C2  Capacitance: 0.1uF  Voltage Rating: 16V  [chip_0603]  (hidden comment: cap_single_np)
C3  Capacitance: 0.1uF  Voltage Rating: 16V  [chip_0603]  (hidden comment: cap_single_np)
C4  Capacitance: 1uF  Voltage Rating: 16V  [chip_0805]  (hidden comment: cap_single_np)
C5  Capacitance: 10000pF  Voltage Rating: 16V  [chip_0603]  (hidden comment: cap_single_np)
C6  Capacitance: 10000pF  Voltage Rating: 16V  [chip_0603]  (hidden comment: cap_single_np)
C7  Capacitance: 0.1uF  Voltage Rating: 16V  [chip_0603]  (hidden comment: cap_single_np)
C8  Capacitance: 10000pF  Voltage Rating: 16V  [chip_0603]  (hidden comment: cap_single_np)
C9  Capacitance: 0.1uF  Voltage Rating: 16V  [chip_0603]  (hidden comment: cap_single_np)
C10  Capacitance: 0.1uF  Voltage Rating: 16V  [chip_0603]  (hidden comment: cap_single_np)
C11  Capacitance: 0.1uF  Voltage Rating: 16V  [chip_0603]  (hidden comment: cap_single_np)
C12  Capacitance: 1uF  Voltage Rating: 16V  [chip_0805]  (hidden comment: cap_single_np)
C13  Capacitance: 0.1uF  Voltage Rating: 16V  [chip_0603]  (hidden comment: cap_single_np)
C14  Capacitance: 10000pF  Voltage Rating: 16V  [chip_0603]  (hidden comment: cap_single_np)
C15  Capacitance: 0.1uF  Voltage Rating: 16V  [chip_0603]  (hidden comment: cap_single_np)
C16  Capacitance: 10000pF  Voltage Rating: 16V  [chip_0603]  (hidden comment: cap_single_np)
C17  Capacitance: 10000pF  Voltage Rating: 16V  [chip_0603]  (hidden comment: cap_single_np)
C18  Capacitance: 10000pF  Voltage Rating: 16V  [chip_0603]  (hidden comment: cap_single_np)
C19  Capacitance: 10000pF  Voltage Rating: 16V  [chip_0603]  (hidden comment: cap_single_np)
F1  PTC_0  [chip_1206]  (value not drawn)
F2  PTC_0  [chip_1206]  (value not drawn)
P1  conn-9x1_x2  [D_SUB_9x2_0]  (value not drawn)  (parts A,B of 2)
R3  Resistance: 10k  Power Rating: 0.25W  [chip_0603]  (hidden comment: res_single)
R5  Resistance: 10k  Power Rating: 0.25W  [chip_0603]  (hidden comment: res_single)
R7  Resistance: 10k  Power Rating: 0.25W  [chip_0603]  (hidden comment: res_single)
R9  Resistance: 10k  Power Rating: 0.25W  [chip_0603]  (hidden comment: res_single)
RN3  Resistance: 10k  [chip_1206_arr]  (hidden comment: res_array_4)  (parts A,B,C,D of 4)
RN4  Resistance: 10k  [chip_1206_arr]  (hidden comment: res_array_4)  (parts A,B,C,D of 4)
U1  Manufacturer PN: ADuM3153BRSZ  [tssop-20_0]  (hidden comment: ADuM3153)
U2  ADS1120  [tssop-16_0]
U3  Manufacturer PN: SN74AHC1G125DBVR  [sot-23-5]  (hidden comment: SN74AHCT1G125)
U4  Manufacturer PN: ADuM3211ARZ  [SO-8]  (hidden comment: ADuM3211)
U5  ADS1120  [tssop-16_0]
U6  Manufacturer PN: TLV272CDR  [so-8]  (hidden comment: TLV272DGK)  (parts A,B of 2)
U7  Manufacturer PN: SN74AHC1G125DBVR  [sot-23-5]  (hidden comment: SN74AHCT1G125)

### Ports
ADC_1_~{CS} (bidir), ADC_1_~{DRDY} (bidir), ADC_2_~{CS} (bidir), ADC_2_~{DRDY} (bidir), SPI_CLK_3V3 (bidir), SPI_MISO_3V3 (bidir), SPI_MOSI_3V3 (bidir)

### Nets
3V3: C1.2 C7.2 C10.2 C15.2 R3.2 R5.2 U1.1(VDD1) U3.5(+V) U4.1(VDD1) U7.5(+V)
+5VA: C3.1 C4.2 C11.1 C12.2 C13.2 U2.12(AVDD) U2.13(DVDD) U5.12(AVDD) U5.13(DVDD) U6.8
+5VO: C2.1 C9.2 F1.2 F2.2 U1.20(VDD2) U4.8(VCC2)
AGND: C2.2 C3.2 C4.1 C5.2 C6.2 C8.2 C9.1 C11.2 C12.1 C13.1 C14.1 C17.2 C18.2 C19.2 P1.3 P1.8 P1.12(3) P1.14(5) P1.18(9) U1.11(GND2) U1.12(VIC) U1.19(GND2) U2.3(CLK) U2.4(DGND) U2.5(AVSS) U2.6(AIN3) U4.5(GND2) U5.3(CLK) U5.4(DGND) U5.5(AVSS) U5.6(AIN3) U6.4
DGND: C1.1 C7.1 C10.1 C15.1 U1.2(GND1) U1.10(GND1) U3.3(G) U4.4(GND1) U7.3(G)
ADC_1_~{CS}: R3.1 U1.6(~{MSS}) U3.1(~{OE}) ; port ADC_1_~{CS}
ADC_1_~{CS}_5V: U1.15(~{SSS}) U2.2(~{CS})
ADC_1_~{DRDY}: U1.7(VOA) ; port ADC_1_~{DRDY}
ADC_1_~{DRDY}_5V: U1.14(VIA) U2.14(~{DRD}Y)
ADC_2_~{CS}: R5.1 U4.3(VOB) U7.1(~{OE}) ; port ADC_2_~{CS}
ADC_2_~{CS}_5V: U4.6(VOB) U5.2(~{CS})
ADC_2_~{DRDY}: U1.8(VOB) ; port ADC_2_~{DRDY}
ADC_2_~{DRDY}_5V: U1.13(VIB) U5.14(~{DRD}Y)
LD_VREFP: F2.1 P1.10(1) P1.15(6) U5.11(AIN0)
POT1: P1.2 RN4.2
POT2: P1.7 RN4.1
POT_VREF: C5.1 RN4.6 U2.11(AIN0)
SPI_CLK_3V3: U1.3(MCLK) ; port SPI_CLK_3V3
SPI_CLK_5V: U1.18(SCLK) U2.1(SCLK) U5.1(SCLK)
SPI_MISO_3V3: U3.4(Y) U7.4(Y) ; port SPI_MISO_3V3
SPI_MOSI_3V3: U1.4(MO) ; port SPI_MOSI_3V3
SPI_MOSI_5V: U1.17(SI) U2.16(DIN) U5.16(DIN)
NetC6_1: C6.1 RN4.7 U2.10(AIN1)
NetC8_1: C8.1 RN4.8 U2.7(AIN2)
NetC14_2: C14.2 C16.1 R7.1 U5.10(AIN1)
NetC16_2: C16.2 C18.1 R9.1 U5.7(AIN2)
NetC17_1: C17.1 RN3.7 RN3.8 U6.3
NetC19_1: C19.1 RN3.5 RN3.6 U6.5
NetF1_1: F1.1 P1.1 P1.6 RN4.3
NetP1_11: P1.11(2) RN3.1
NetP1_13: P1.13(4) RN3.3
NetP1_16: P1.16(7) RN3.2
NetP1_17: P1.17(8) RN3.4
NetR7_2: R7.2 U6.1 U6.2
NetR9_2: R9.2 U6.6 U6.7
NetU1_5: U1.5(MI) U3.2(A)
NetU1_16: U1.16(SO) U2.15(DOUT)
NetU4_2: U4.2(VOA) U7.2(A)
NetU4_7: U4.7(VIA) U5.15(DOUT)

Not connected (* = marked no-connect by the designer): P1 4* 5* 9*; RN4 4* 5*; U1 9(VOC)*; U2 8(REFN0)* 9(REFP0)*; U5 8(REFN0)* 9(REFP0)*

### Notes on the sheet
- (near P1) Analog Inputs
- (near P1) Load-Cell Inputs
- Title
- Size:
- B
- Number:
- Revision:
- Date:
- Sheet
- of
- (in symbol ANLG-00030, part A) VCC; VSS

### Library data of the parts
C1-C3 C7 C9-C11 C13 C15 = CAP-00542: as C30 on sheet power_SCH1; Tolerance: ±10%; Part Number: CAP-00542; Type: X7R
C4 C12 = CAP-00107: CAP, 1uF, 10%, 16V, X7R, 0805; Manufacturer: Murata; Manufacturer PN: GRM21BR71C105KA01L; Tolerance: 10%; Part Number: CAP-00107; Type: X7R
C5 C6 C8 C14 C16-C19 = CAP-00543: CAP, 10000pF, ±10%, 16V, X7R, 0603; Tolerance: ±10%; Part Number: CAP-00543; Type: X7R
F1 F2 = MISC-00008: as F3 on sheet IO_SCH3; TEMP_CO: *; Part Number: MISC-00008; Cost: 0.3
P1 = CONN-00025: as P3 on sheet IO_SCH3; Part Number: CONN-00025; Type: Thru-hole; Cost: 7.32; Weight: 22.69
R3 R5 R7 R9 = RES-00306: as R41 on sheet power_SCH1; Tolerance: 1%; Part Number: RES-00306; Cost: 0.144
RN3 RN4 = RES-00697: RES ARRAY 4 RES 10k OHM 5% 1/16W 1206; Manufacturer PN: 742C083103JP; Manufacturer: CTS Resistor Products; Tolerance: 0.05; Power Rating: 1/16W; Part Number: RES-00697; Cost: 0.27
U1 = IFACE-00014: Digital Isolator, SPI-bus optomized, ADuM3153; Manufacturer: Analog Devices; Part Number: IFACE-00014; Cost: 6.75
U2 U5 = ANLG-00016: ADC, 16-bit, 4-channel, SPI, 2k SPS, TSSOP-16; Manufacturer: TI; Datasheet Link: http://www.ti.com/lit/ds/symlink/ads1120.pdf; Part Number: ANLG-00016; Manufacturer PN: ADS1120; Cost: 6.8
U3 U7 = LOGIC-00027: Tri-State Buffer, Single, 2-5.5V, SOT-23-5, SN74AHC1G125; Manufacturer: TI; Part Number: LOGIC-00027; Cost: $0.33
U4 = IFACE-00015: as U14 on sheet IO_SCH3; Part Number: IFACE-00015; Cost: 2.87
U6 = ANLG-00030: Op Amp, Dual, Rail-Rail, 3MHZ, SOIC-8; Manufacturer: TI; Part Number: ANLG-00030; Cost: 0.9

## Nets that join several sheets
3V3: power_SCH1 (C42.1 D4.2 U17.2 U17.4), BBB_SCH2 (15 pins), IO_SCH3 (13 pins), Analog_SCH4 (10 pins)
+5VA: power_SCH1 (C37.1 C40.1 L3.1 U16.4), Analog_SCH4 (10 pins)
+5VD: power_SCH1 (10 pins), BBB_SCH2 (P7.1 R12.2 U8.51 U8.52)
+5VO: power_SCH1 (C38.1 D5.2 L3.2 R42.1), IO_SCH3 (15 pins), Analog_SCH4 (6 pins)
AGND: power_SCH1 (9 pins), IO_SCH3 (21 pins), Analog_SCH4 (32 pins)
DGND: power_SCH1 (28 pins), BBB_SCH2 (18 pins), IO_SCH3 (15 pins), Analog_SCH4 (9 pins)
24V_PRESENT: BBB_SCH2 (U8.11), IO_SCH3 (R46.1 U18.3)
ADC_1_~{CS}: BBB_SCH2 (R50.2 U8.8), Analog_SCH4 (R3.1 U1.6 U3.1)
ADC_1_~{DRDY}: BBB_SCH2 (U8.12), Analog_SCH4 (U1.7)
ADC_2_~{CS}: BBB_SCH2 (R51.2 U8.10), Analog_SCH4 (R5.1 U4.3 U7.1)
ADC_2_~{DRDY}: BBB_SCH2 (U8.18), Analog_SCH4 (U1.8)
CAN_RX: BBB_SCH2 (U8.70), IO_SCH3 (U12.3)
CAN_TX: BBB_SCH2 (U8.72), IO_SCH3 (U12.6)
LIMIT_SIG_1: BBB_SCH2 (U8.58), IO_SCH3 (RN5.4 U11.9)
LIMIT_SIG_2: BBB_SCH2 (U8.61), IO_SCH3 (RN5.3 U11.11)
LIMIT_SIG_3: BBB_SCH2 (U8.69), IO_SCH3 (RN5.2 U11.13)
LIMIT_SIG_4: BBB_SCH2 (U8.71), IO_SCH3 (RN5.1 U11.15)
LIMIT_SIG_5: BBB_SCH2 (U8.73), IO_SCH3 (RN1.1 U13.15)
LIMIT_SIG_6: BBB_SCH2 (U8.87), IO_SCH3 (RN1.2 U13.13)
SPARE_1: BBB_SCH2 (U8.16), IO_SCH3 (RN1.3 U13.11)
SPARE_2: BBB_SCH2 (U8.15), IO_SCH3 (RN1.4 U13.9)
SPI_CLK_3V3: BBB_SCH2 (P7.3 U8.77 U9.13 U10.1), Analog_SCH4 (U1.3)
SPI_MISO_3V3: BBB_SCH2 (P7.5 U8.75 U9.1 U10.2), Analog_SCH4 (U3.4 U7.4)
SPI_MOSI_3V3: BBB_SCH2 (P7.4 U8.76 U9.14 U10.3), Analog_SCH4 (U1.4)
UART_RX_3V3: BBB_SCH2 (U8.68), IO_SCH3 (U14.2)
UART_TX_3V3: BBB_SCH2 (U8.67), IO_SCH3 (U14.3)